# Altium schematic sheet MCU.SchDoc
size B; DrawnBy: PWS; Engineer: PWS; Organization: WIPAC; Revision: 1; SheetNumber: 4; SheetTotal: 7; DocumentNumber: 4
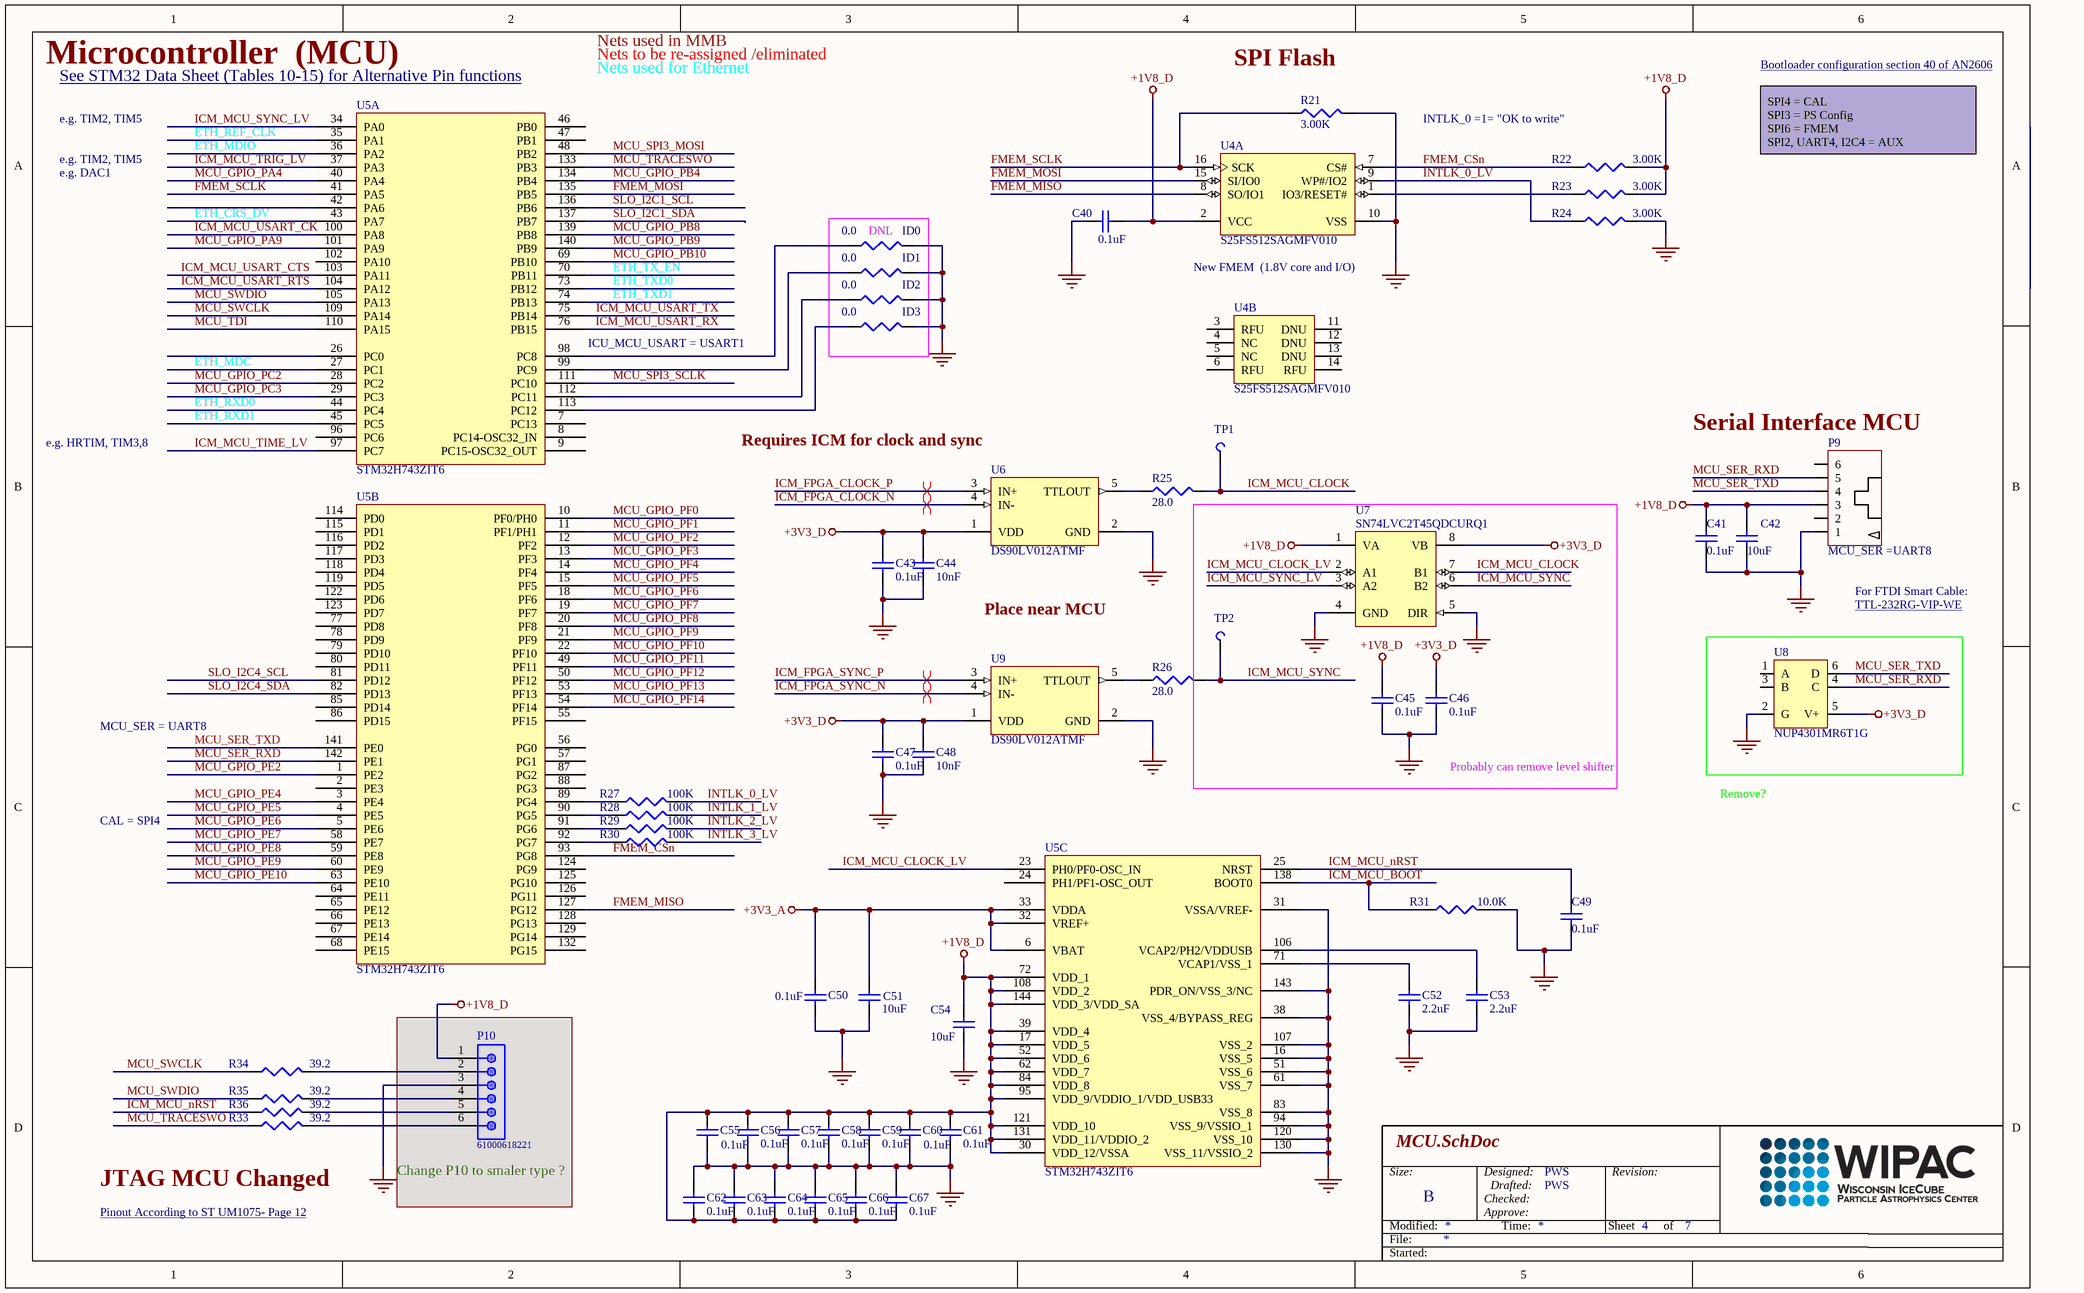
[diagram p0: MCU.SchDoc]

## Parts
C40  Capacitance: 0.1uF  [CAPC_0603]  (hidden comment: 0.1uF_603_50V)
C41  Capacitance: 0.1uF  [CAPC_0603]  (hidden comment: 0.1uF_603_50V)
C42  Capacitance: 10uF  [CAPC_1206]  (hidden comment: 10uF_1206_16V)
C43  Capacitance: 0.1uF  [CAPC_0603]  (hidden comment: 0.1uF_603_50V)
C44  10nF  [CAPC1608X90X35LL10T15]
C45  Capacitance: 0.1uF  [CAPC_0603]  (hidden comment: 0.1uF_603_50V)
C46  Capacitance: 0.1uF  [CAPC_0603]  (hidden comment: 0.1uF_603_50V)
C47  Capacitance: 0.1uF  [CAPC_0603]  (hidden comment: 0.1uF_603_50V)
C48  10nF  [CAPC1608X90X35LL10T15]
C49  Capacitance: 0.1uF  [CAPC_0603]  (hidden comment: 0.1uF_603_50V)
C50  Capacitance: 0.1uF  [CAPC_0603]  (hidden comment: 0.1uF_603_50V)
C51  Capacitance: 10uF  [CAPC_0805]  (hidden comment: 10uF_805_10V)
C52  Capacitance: 2.2uF  [CAPC_0805]  (hidden comment: 2.2uF_805_16V)
C53  Capacitance: 2.2uF  [CAPC_0805]  (hidden comment: 2.2uF_805_16V)
C54  Capacitance: 10uF  [CAPC_0805]  (hidden comment: 10uF_805_10V)
C55  Capacitance: 0.1uF  [CAPC_0603]  (hidden comment: 0.1uF_603_50V)
C56  Capacitance: 0.1uF  [CAPC_0603]  (hidden comment: 0.1uF_603_50V)
C57  Capacitance: 0.1uF  [CAPC_0603]  (hidden comment: 0.1uF_603_50V)
C58  Capacitance: 0.1uF  [CAPC_0603]  (hidden comment: 0.1uF_603_50V)
C59  Capacitance: 0.1uF  [CAPC_0603]  (hidden comment: 0.1uF_603_50V)
C60  Capacitance: 0.1uF  [CAPC_0603]  (hidden comment: 0.1uF_603_50V)
C61  Capacitance: 0.1uF  [CAPC_0603]  (hidden comment: 0.1uF_603_50V)
C62  Capacitance: 0.1uF  [CAPC_0603]  (hidden comment: 0.1uF_603_50V)
C63  Capacitance: 0.1uF  [CAPC_0603]  (hidden comment: 0.1uF_603_50V)
C64  Capacitance: 0.1uF  [CAPC_0603]  (hidden comment: 0.1uF_603_50V)
C65  Capacitance: 0.1uF  [CAPC_0603]  (hidden comment: 0.1uF_603_50V)
C66  Capacitance: 0.1uF  [CAPC_0603]  (hidden comment: 0.1uF_603_50V)
C67  Capacitance: 0.1uF  [CAPC_0603]  (hidden comment: 0.1uF_603_50V)
ID0  Resistance: 0.0  [RES_0603]  (hidden comment: R_ZERO_805)  (no BOM)
ID1  Resistance: 0.0  [RES_0603]  (hidden comment: R_ZERO_805)  (no BOM)
ID2  Resistance: 0.0  [RES_0603]  (hidden comment: R_ZERO_805)  (net tie, no BOM)
ID3  Resistance: 0.0  [RES_0603]  (hidden comment: R_ZERO_805)  (no BOM)
P9  MCU_SER =UART8  [Header Male 6 Vert]
P10  61000618221  [61000618221]
R21  Resistance: 3.00K  [RES_0603]  (hidden comment: R_3.00K_603_1%)
R22  Resistance: 3.00K  [RES_0603]  (hidden comment: R_3.00K_603_1%)
R23  Resistance: 3.00K  [RES_0603]  (hidden comment: R_3.00K_603_1%)
R24  Resistance: 3.00K  [RES_0603]  (hidden comment: R_3.00K_603_1%)
R25  Resistance: 28.0  [RES_0603]  (hidden comment: R_28.0_603_1%)
R26  Resistance: 28.0  [RES_0603]  (hidden comment: R_28.0_603_1%)
R27  Resistance: 100K  [RES_0603]  (hidden comment: R_100K_603_1%)
R28  Resistance: 100K  [RES_0603]  (hidden comment: R_100K_603_1%)
R29  Resistance: 100K  [RES_0603]  (hidden comment: R_100K_603_1%)
R30  Resistance: 100K  [RES_0603]  (hidden comment: R_100K_603_1%)
R31  value 10.0K  [RES_0603]  (hidden comment: R_10.0K_603_1%)
R33  Resistance: 39.2  [RES_0603]  (hidden comment: R_39.2_603_1%)
R34  Resistance: 39.2  [RES_0603]  (hidden comment: R_39.2_603_1%)
R35  Resistance: 39.2  [RES_0603]  (hidden comment: R_39.2_603_1%)
R36  Resistance: 39.2  [RES_0603]  (hidden comment: R_39.2_603_1%)
TP1  PC TEST POINT MINI SMD  [Test Point SM]  (value not drawn)
TP2  PC TEST POINT MINI SMD  [Test Point SM]  (value not drawn)
U4  S25FS512SAGMFV010  [MICT-SF-16_N]  (parts A,B of 2)
U5  STM32H743ZIT6  [STM-LQFP144_N]  (parts A,B,C of 3)
U6  DS90LV012ATMF  [MF05A_N]
U7  SN74LVC2T45QDCURQ1  [TI-DGK8_N]
U8  NUP4301MR6T1G  [ONSC-SC-74-6-318F-05_V]
U9  DS90LV012ATMF  [MF05A_N]

## Blocks framed on the sheet
DNL: ID0-ID3
Probably can remove level shifter: C45 C46 TP2 U7
Change P10 to smaler type ?: P10

## Nets
+1V8_D: C40.1 C41.2 C42.2 C45.2 C54.2 C55.2 C56.2 C57.2 C58.2 C59.2 C60.2 C61.2 C62.1 C63.1 C64.1 C65.1 C66.1 C67.1 P9.3 P10.1 R22.2 R23.2 U4.2(VCC) U5.17(VDD_5) U5.30(VDD_12/VSSA) U5.39(VDD_4) U5.52(VDD_6) U5.62(VDD_7) U5.72(VDD_1) U5.84(VDD_8) U5.95(VDD_9/VDDIO_1/VDD_USB33) U5.108(VDD_2) U5.121(VDD_10) U5.131(VDD_11/VDDIO_2) U5.144(VDD_3/VDD_SA) U7.1(VA)
+3V3_A: C50.2 C51.2 U5.6(VBAT) U5.32(VREF+) U5.33(VDDA)
+3V3_D: C43.2 C44.2 C46.2 C47.2 C48.2 U6.1(VDD) U7.8(VB) U8.5(V+) U9.1(VDD)
GND: C40.2 C41.1 C42.1 C43.1 C44.1 C45.1 C46.1 C47.1 C48.1 C49.1 C50.1 C51.1 C52.1 C53.1 C54.1 C55.1 C56.1 C57.1 C58.1 C59.1 C60.1 C61.1 C62.2 C63.2 C64.2 C65.2 C66.2 C67.2 ID0.2 ID1.2 ID2.2 ID3.2 P9.1 P10.3 R21.2 R24.2 R31.2 U4.10(VSS) U5.16(VSS_5) U5.31(VSSA/VREF-) U5.38(VSS_4/BYPASS_REG) U5.51(VSS_6) U5.61(VSS_7) U5.83(VSS_8) U5.94(VSS_9/VSSIO_1) U5.107(VSS_2) U5.120(VSS_10) U5.130(VSS_11/VSSIO_2) U5.143(PDR_ON/VSS_3/NC) U6.2(GND) U7.4(GND) U7.5(DIR) U8.2(G) U9.2(GND)
ETH_CRS_DV: U5.43(PA7)
ETH_MDC: U5.27(PC1)
ETH_MDIO: U5.36(PA2)
ETH_REF_CLK: U5.35(PA1)
ETH_RXD0: U5.44(PC4)
ETH_RXD1: U5.45(PC5)
ETH_TX_EN: U5.70(PB11)
ETH_TXD0: U5.73(PB12)
ETH_TXD1: U5.74(PB13)
FMEM_CSn: R22.1 U4.7(CS#) U5.93(PG8)
FMEM_MISO: U4.8(SO/IO1) U5.127(PG12)
FMEM_MOSI: U4.15(SI/IO0) U5.135(PB5)
FMEM_SCLK: R21.1 U4.16(SCK) U5.41(PA5)
ICM_FPGA_CLOCK_N: U6.4(IN-)
ICM_FPGA_CLOCK_P: U6.3(IN+)
ICM_FPGA_SYNC_N: U9.4(IN-)
ICM_FPGA_SYNC_P: U9.3(IN+)
ICM_MCU_BOOT: R31.1 U5.138(BOOT0)
ICM_MCU_CLOCK: R25.2 TP1.1 U7.7(B1)
ICM_MCU_CLOCK_LV: U5.23(PH0/PF0-OSC_IN) U7.2(A1)
ICM_MCU_nRST: C49.2 R36.1 U5.25(NRST)
ICM_MCU_SYNC: R26.2 TP2.1 U7.6(B2)
ICM_MCU_SYNC_LV: U5.34(PA0) U7.3(A2)
ICM_MCU_TIME_LV: U5.97(PC7)
ICM_MCU_TRIG_LV: U5.37(PA3)
ICM_MCU_USART_CK: U5.100(PA8)
ICM_MCU_USART_CTS: U5.103(PA11)
ICM_MCU_USART_RTS: U5.104(PA12)
ICM_MCU_USART_RX: U5.76(PB15)
ICM_MCU_USART_TX: U5.75(PB14)
INTLK_0_LV: R24.1 R27.2 U4.9(WP#/IO2)
INTLK_1_LV: R28.2
INTLK_2_LV: R29.2
INTLK_3_LV: R30.2
MCU_GPIO_PA4: U5.40(PA4)
MCU_GPIO_PA9: U5.101(PA9)
MCU_GPIO_PB4: U5.134(PB4)
MCU_GPIO_PB8: U5.139(PB8)
MCU_GPIO_PB9: U5.140(PB9)
MCU_GPIO_PB10: U5.69(PB10)
MCU_GPIO_PC2: U5.28(PC2)
MCU_GPIO_PC3: U5.29(PC3)
MCU_GPIO_PE2: U5.1(PE2)
MCU_GPIO_PE4: U5.3(PE4)
MCU_GPIO_PE5: U5.4(PE5)
MCU_GPIO_PE6: U5.5(PE6)
MCU_GPIO_PE7: U5.58(PE7)
MCU_GPIO_PE8: U5.59(PE8)
MCU_GPIO_PE9: U5.60(PE9)
MCU_GPIO_PE10: U5.63(PE10)
MCU_GPIO_PF0: U5.10(PF0/PH0)
MCU_GPIO_PF1: U5.11(PF1/PH1)
MCU_GPIO_PF2: U5.12(PF2)
MCU_GPIO_PF3: U5.13(PF3)
MCU_GPIO_PF4: U5.14(PF4)
MCU_GPIO_PF5: U5.15(PF5)
MCU_GPIO_PF6: U5.18(PF6)
MCU_GPIO_PF7: U5.19(PF7)
MCU_GPIO_PF8: U5.20(PF8)
MCU_GPIO_PF9: U5.21(PF9)
MCU_GPIO_PF10: U5.22(PF10)
MCU_GPIO_PF11: U5.49(PF11)
MCU_GPIO_PF12: U5.50(PF12)
MCU_GPIO_PF13: U5.53(PF13)
MCU_GPIO_PF14: U5.54(PF14)
MCU_SER_RXD: P9.5 U5.142(PE1) U8.4(C)
MCU_SER_TXD: P9.4 U5.141(PE0) U8.6(D)
MCU_SPI3_MOSI: U5.48(PB2)
MCU_SPI3_SCLK: U5.111(PC10)
MCU_SWCLK: R34.1 U5.109(PA14)
MCU_SWDIO: R35.1 U5.105(PA13)
MCU_TDI: U5.110(PA15)
MCU_TRACESWO: R33.1 U5.133(PB3)
SLO_I2C1_SCL: U5.136(PB6)
SLO_I2C1_SDA: U5.137(PB7)
SLO_I2C4_SCL: U5.81(PD12)
SLO_I2C4_SDA: U5.82(PD13)
NetC52_2: C52.2 U5.71(VCAP1/VSS_1)
NetC53_2: C53.2 U5.106(VCAP2/PH2/VDDUSB)
NetID0_1: ID0.1 U5.98(PC8)
NetID1_1: ID1.1 U5.99(PC9)
NetID2_1: ID2.1 U5.112(PC11)
NetID3_1: ID3.1 U5.113(PC12)
NetP10_2: P10.2 R34.2
NetP10_4: P10.4 R35.2
NetP10_5: P10.5 R36.2
NetP10_6: P10.6 R33.2
NetR23_1: R23.1 U4.1(IO3/RESET#)
NetR25_1: R25.1 U6.5(TTLOUT)
NetR26_1: R26.1 U9.5(TTLOUT)
NetR27_1: R27.1 U5.89(PG4)
NetR28_1: R28.1 U5.90(PG5)
NetR29_1: R29.1 U5.91(PG6)
NetR30_1: R30.1 U5.92(PG7)

Not connected (* = marked no-connect by the designer): P9 2 6; U4 3(RFU) 4(NC) 5(NC) 6(RFU) 11(DNU) 12(DNU) 13(DNU) 14(RFU); U5 2(PE3) 7(PC13) 8(PC14-OSC32_IN) 9(PC15-OSC32_OUT) 24(PH1/PF1-OSC_OUT) 26(PC0) 42(PA6) 46(PB0) 47(PB1) 55(PF15) 56(PG0) 57(PG1) 64(PE11) 65(PE12) 66(PE13) 67(PE14) 68(PE15) 77(PD8) 78(PD9) 79(PD10) 80(PD11) 85(PD14) 86(PD15) 87(PG2) 88(PG3) 96(PC6) 102(PA10) 114(PD0) 115(PD1) 116(PD2) 117(PD3) 118(PD4) 119(PD5) 122(PD6) 123(PD7) 124(PG9) 125(PG10) 126(PG11) 128(PG13) 129(PG14) 132(PG15); U8 1(A) 3(B)

## Layout directives
differential pair: ICM_FPGA_CLOCK_N, ICM_FPGA_CLOCK_P, ICM_FPGA_SYNC_N, ICM_FPGA_SYNC_P

## Notes on the sheet
- Microcontroller  (MCU)
- (near U5) See STM32 Data Sheet (Tables 10-15) for Alternative Pin functions
- Nets to be re-assigned /eliminated
- Nets used in MMB
- Nets used for Ethernet
- (near R21) SPI Flash
- Bootloader configuration section 40 of AN2606
- e.g. TIM2, TIM5
- (near R22) INTLK_0 =1= "OK to write"
- SPI4 = CAL
  SPI3 = PS Config
  SPI6 = FMEM
  SPI2, UART4, I2C4 = AUX
- e.g. DAC1
- (near U4) New FMEM  (1.8V core and I/O)
- ICU_MCU_USART = USART1
- (near P9) Serial Interface MCU
- e.g. HRTIM, TIM3,8
- (near U6) Requires ICM for clock and sync
- Place near MCU
- For FTDI Smart Cable:
- TTL-232RG-VIP-WE
- MCU_SER = UART8
- CAL = SPI4
- Remove?
- JTAG MCU Changed
- Pinout According to ST UM1075- Page 12
- Size:
- Designed:
- Revision:
- Modified:
- File:
- B
- Checked:
- Approve:
- Drafted:
- Time:
- Sheet
- of
- Started:

## Library data of the parts
C40 C43 C45-C47 C50 C55-C67 = CapC_0.1uF_603_50V: 0.1µF ±10% 50V Ceramic Capacitor X7R 0603 (1608 Metric); Manufacturer: TDK; Manufacturer Part Number: CGJ3E2X7R1H104K080AA; Ratings: COTS; ComponentLink1Description: Datasheet; ComponentLink1URL: https://product.tdk.com/info/en/catalog/datasheets/mlcc_highreliability_general_en.pdf; ComponentLink2Description: Supplier Link; ComponentLink2URL: https://www.digikey.com/products/en?keywords=445-8122-1-ND; Supplier 1: Digi-Key; Stock 1: 697211; Pricing 1: 1 = 0.22000, 10 = 0.15300, 100 = 0.07740, 500 = 0.05294, 1000 = 0.04683 (USD); RoHS: Yes; Mount: Surface Mount; Case/Package: 0603; Weight: 7.1E-05oz; Case Code (Imperial): 0603; Case Code (Metric): 1608; Min Operating Temperature: -55°C; Max Operating Temperature: 125°C; Tolerance: 10%; Voltage Rating: 50V; Voltage Rating (DC): 50V; Packaging: Tape and Reel; Package Quantity: 1; Dielectric: X7R; Termination: SMD/SMT; Composition: Ceramic; Length: 1.6mm; Height: 0.8mm; Width: 0.8mm; Thickness: 0.035inch; Depth: 0.8mm; Radiation Hardening: No; Lead Free: Lead Free; Supplier Part Number 1: 445-8122-1-ND
C41 C49 = CapC_0.1uF_603_50V_GCJ: 0.1µF ±10% 50V Ceramic Capacitor X7R 0603 (1608 Metric); Manufacturer: Murata; Manufacturer Part Number: GCJ188R71H104KA12D; Supplier 1: Digi-Key; Supplier Part Number 1: 490-5798-1-ND; RoHS: Yes; Packaging: Tape and Reel; Tolerance: 10%; Ratings: AEC-Q200; ComponentLink1URL: https://psearch.en.murata.com/capacitor/product/GCJ188R71H104KA12%23.pdf; ComponentLink1Description: Datasheet; ComponentLink2Description: Supplier Link; ComponentLink2URL: https://www.digikey.com/products/en?keywords=490-5798-1-ND; Stock 1: 2321609; Pricing 1: 1=0.28000, 10=0.19200, 100=0.10890, 500=0.07686, 1000=0.06725 (USD); Mount: Surface Mount; Case/Package: 0603; Case Code (Imperial): 0603; Case Code (Metric): 1608; Min Operating Temperature: -55°C; Max Operating Temperature: 125°C; Voltage Rating: 50V; Dielectric: X7R; Termination: SMD/SMT; Voltage Rating (DC): 50V; Package Quantity: 1; Length: 1.6mm; Height: 0.8mm; Width: 0.031inch; Thickness: 0.035inch; Features: Soft Termination; Depth: 0.8mm; Radiation Hardening: No; Lead Free: Lead Free
C42 = CapC_10uF_1206_16V: Capacitor; Manufacturer: Murata; Manufacturer Part Number: GCJ31CR71C106KA15L; Voltage Rating: 16V; Tolerance: 10%; Dielectric: X7R; Supplier 1: Digi-Key; Stock 1: 43020; Pricing 1: 1 = 0.79000, 10 = 0.56200, 100 = 0.36990, 500 = 0.27402, 1000 = 0.23292 (USD); RoHS: Yes; Mount: Surface Mount; Case/Package: 1206; Case Code (Metric): 3216; Case Code (Imperial): 1206; Min Operating Temperature: -55°C; Max Operating Temperature: 125°C; Package Quantity: 2000; Packaging: Tape and Reel; Termination: SMD/SMT; Voltage Rating (DC): 16V; Features: Soft Termination; Length: 0.126inch; Width: 1.6mm; Thickness: 0.075inch; Ratings: AEC-Q200; ComponentLink1URL: https://www.murata.com/~/media/webrenewal/support/library/catalog/products/capacitor/mlcc/c03e.ashx?la=en-us; ComponentLink1Description: Datasheet; Supplier Part Number 1: 490-10558-1-ND; ComponentLink2Description: Supplier Link; ComponentLink2URL: https://www.digikey.com/products/en?keywords=490-10558-1-ND; Weight: 0.001411oz; Height: 1.25mm
C44 C48 = CMP-2000-06338-1: Chip Capacitor, 10000 pF, +/- 10%, 16 V, -55 to 125 degC, 0603 (1608 Metric), RoHS, Tape and Reel; Manufacturer: Murata; Rated Voltage: 16V; Dielectric: X7R; Mounting Technology: SurfaceMount; Tolerance (%): ±10%; Case Size/Dimension: 0603; Datasheet URL: http://search.murata.co.jp/Ceramy/image/img/A01X/G101/ENG/GRM188R71C103KA01-01.pdf; Datasheet Version: 02/2016; Manufacturer URL: http://www.murata.com/; Package Reference: 0603; Package Description: 2-Pin Surface Mount Device, Body 1.6 x 0.8 mm; Capacitance: 10nF
C51 C54 = CapC_10uF_805_10V: Capacitor; Manufacturer: Murata; Manufacturer Part Number: GCJ21BR71A106KE01L; Tolerance: 10%; Dielectric: X7R; Voltage Rating: 10V; Supplier 1: Digi-Key; Supplier Part Number 1: 490-12646-1-ND; RoHS: Yes; ComponentLink1URL: https://www.murata.com/~/media/webrenewal/support/library/catalog/products/capacitor/mlcc/c03e.ashx?la=en-us; ComponentLink1Description: Datasheet; Stock 1: 140399; Pricing 1: 1 = 0.70000, 10 = 0.49300, 100 = 0.32440, 500 = 0.24032, 1000 = 0.20428 (USD); ComponentLink2URL: https://www.digikey.com/products/en?keywords=490-12646-1-ND; ComponentLink2Description: Supplier Link; Mount: Surface Mount; Case/Package: 0805; Weight: 0.000335oz; Case Code (Metric): 2012; Case Code (Imperial): 0805; Min Operating Temperature: -55°C; Max Operating Temperature: 125°C; Packaging: Tape and Reel; Termination: SMD/SMT; Voltage Rating (DC): 10V; Package Quantity: 3000; Features: Soft Termination; Length: 2mm; Height: 1.25mm; Width: 0.049inch; Thickness: 0.057inch; Depth: 1.25mm; Ratings: AEC-Q200
C52 C53 = CapC_2.2uF_805_16V: CAP CER 2.2UF 16V X7R 0805; Manufacturer: Murata; Manufacturer Part Number: GCJ21BR71C225KA13L; Tolerance: 10%; Supplier 1: Digi-Key; Stock 1: 18374; Pricing 1: 1 = 0.52000, 10 = 0.35900, 100 = 0.21520, 500 = 0.16138, 1000 = 0.13628 (USD); RoHS: Yes; Mount: Surface Mount; Case/Package: 0805; Case Code (Metric): 2012; Case Code (Imperial): 0805; Min Operating Temperature: -55°C; Max Operating Temperature: 125°C; Packaging: Tape and Reel; Voltage Rating: 16V; Length: 2mm; Width: 0.049inch; Thickness: 0.057inch; Ratings: AEC-Q200; Supplier Part Number 1: 490-5801-1-ND; ComponentLink1Description: Supplier Link; ComponentLink1URL: https://www.digikey.com/products/en?keywords=490-5801-1-ND; ComponentLink2Description: Datasheet; ComponentLink2URL: https://psearch.en.murata.com/capacitor/product/GCJ21BR71C225KA13%23.pdf; Features: Soft Termination; Package Quantity: 1; Dielectric: X7R; Termination: SMD/SMT; Voltage Rating (DC): 16V; Height: 1.25mm; Depth: 1.25mm; Radiation Hardening: No; Lead Free: Lead Free; ComponentLink3URL: https://datasheet.ciiva.com/172/product-172726.pdf?src-supplier=Digi-Key; ComponentLink3Description: https://datasheet.ciiva.com/172/product-172726.pdf?src-supplier=Digi-Key; ComponentLink4URL: https://datasheet.ciiva.com/172/s0717e-172727.pdf?src-supplier=Digi-Key; ComponentLink4Description: https://datasheet.ciiva.com/172/s0717e-172727.pdf?src-supplier=Digi-Key; ComponentLink5URL: https://datasheet.ciiva.com/172/s0717e-172728.pdf?src-supplier=Digi-Key; ComponentLink5Description: https://datasheet.ciiva.com/172/s0717e-172728.pdf?src-supplier=Digi-Key
ID0-ID3 = R_ZERO_805: RES ZERO OHM 0805 SMD; Manufacturer: Panasonic; Manufacturer Part Number: ERJ6GEY0R00V; Voltage Rating: 150V; Power Rating: 125mW; Tolerance: 5%; Temperature Coefficient: 600ppm/°C; Current Rating: 2A; Supplier 1: Digi-Key; Stock 1: 5556612; Pricing 1: 1 = 0.10000, 10 = 0.06000, 25 = 0.04320, 50 = 0.03300, 100 = 0.02430, 250 = 0.01852, 500 = 0.01482, 1000 = 0.01090 (USD); RoHS: Yes; Mount: Surface Mount; Case/Package: 0805; Contact Plating: Tin; Case Code (Imperial): 0805; Case Code (Metric): 2012; Min Operating Temperature: -55°C; Max Operating Temperature: 155°C; Composition: Thick Film; Packaging: Tape and Reel; Package Quantity: 1; Termination: SMD/SMT; Number of Terminations: 2; Military Standard: Not; Max Power Dissipation: 125mW; Voltage Rating (DC): 150V; Features: Automotive AEC-Q200; Length: 2mm; Height: 0.6mm; Width: 1.25mm; Depth: 1.25mm; Radiation Hardening: No; Lead Free: Lead Free; REACH SVHC: No SVHC; ComponentLink1URL: https://datasheet.ciiva.com/11821/0900766b80f806dd-11821735.pdf?src-supplier=RSComponents; ComponentLink1Description: https://datasheet.ciiva.com/11821/0900766b80f806dd-11821735.pdf?src-supplier=RSComponents; ComponentLink2URL: https://datasheet.ciiva.com/36526/1989607-36526237.pdf?src-supplier=Jameco; ComponentLink2Description: https://datasheet.ciiva.com/36526/1989607-36526237.pdf?src-supplier=Jameco; ComponentLink3URL: https://datasheet.ciiva.com/28695/1678796-28695877.pdf?src-supplier=Element14; ComponentLink3Description: https://datasheet.ciiva.com/28695/1678796-28695877.pdf?src-supplier=Element14; ComponentLink4URL: https://datasheet.ciiva.com/43460/1678796-43460073.pdf?src-supplier=Farnell; ComponentLink4Description: https://datasheet.ciiva.com/43460/1678796-43460073.pdf?src-supplier=Farnell; ComponentLink5URL: https://datasheet.ciiva.com/9117/aoa0000ce1-9117354.pdf?src-supplier=Avnet; ComponentLink5Description: https://datasheet.ciiva.com/9117/aoa0000ce1-9117354.pdf?src-supplier=Avnet; ComponentLink6URL: https://datasheet.ciiva.com/46377/1678796-46377866.pdf?src-supplier=Element14; ComponentLink6Description: https://datasheet.ciiva.com/46377/1678796-46377866.pdf?src-supplier=Element14; ComponentLink7URL: https://datasheet.ciiva.com/17215/aoa0000ce1-17215390.pdf?src-supplier=Avnet+Europe; ComponentLink7Description: https://datasheet.ciiva.com/17215/aoa0000ce1-17215390.pdf?src-supplier=Avnet+Europe; ComponentLink8URL: https://datasheet.ciiva.com/16512/aoa0000ce1-16512111.pdf?src-supplier=Avnet+Asia; ComponentLink8Description: https://datasheet.ciiva.com/16512/aoa0000ce1-16512111.pdf?src-supplier=Avnet+Asia; Supplier Part Number 1: P0.0ACT-ND
P9 = Header Male SL-6-VERT: CONN HEADER 6POS .100 VERT 30AU; Manufacturer: Molex; Manufacturer Part Number: 0705430110; Connector Type: Male Pin; Number of Positions: 6; Pitch: 2.54mm; Contact Resistance: 30mR; Supplier 1: Digi-Key; RoHS: Yes; Stock 1: 1397; Pricing 1: 1=1.87000, 10=1.69400, 100=1.45240, 500=1.21030, 1440=1.03740, 5760=0.91983, 10080=0.89908 (USD); Packaging: Rail/Tube; Number of Rows: 1; Contact Mating Length: 0.24inch; Termination: Solder; Color: Black; ComponentLink1URL: https://datasheet.ciiva.com/3933/189370705430110-pcb-headers-3933231.pdf?src-supplier=Arrow; ComponentLink1Description: https://datasheet.ciiva.com/3933/189370705430110-pcb-headers-3933231.pdf?src-supplier=Arrow; Supplier Part Number 1: WM4126-ND; Mount: Through Hole; Contact Plating: Gold; Contact Material: Bronze; Housing Material: Polyester; Housing Color: Black; Min Operating Temperature: -40°C; Max Operating Temperature: 105°C; Number of Contacts: 6; Orientation: Straight; Length: 17.79mm; Depth: 6.6mm; ComponentLink2URL: https://datasheet.ciiva.com/6831/705430106-sd-6831991.pdf?src-supplier=Digi-Key; ComponentLink2Description: https://datasheet.ciiva.com/6831/705430106-sd-6831991.pdf?src-supplier=Digi-Key
P10 = 61000618221: WR-PHD Pin Header, SMT, pitch 2.54mm, Single Row, Vertical, 6pin; Pin Number: 6; Gender: Male; Rated Current: 3A; Working Voltage: 250VAC; Withstanding Voltage: 500VAC; Contact Resistance: 20mOhm; ComponentLink1Description: Manufacturer; ComponentLink1URL: http://www.we-online.de; ComponentLink2Description: Datasheet; ComponentLink2URL: https://katalog.we-online.de/em/datasheet/6100xx18221.pdf; Part Number: 61000618221; Published Date: June 2019; Publisher: Wurth Elektronik; Pitch: 2.54mm; Operating Temperature: -40 to +125degC; Mounting Technology: SMT; Packaging: Tube; Row Number: Single; Orientation: Vertical
R21-R24 = R_3.00K_603_1%: RES 3.00K OHM 1/10W 1% 0603 SMD; Manufacturer: Panasonic; Manufacturer Part Number: ERJ3EKF3001V; Temperature Coefficient: 100ppm/°C; Power Rating: 100mW; Voltage Rating: 75V; Supplier 1: Digi-Key; Supplier Part Number 1: P3.00KHCT-ND; RoHS: Yes; Packaging: Tape and Reel; Tolerance: 1%; Composition: Thick Film; Features: Automotive AEC-Q200; Height: 0.022inch; Number of Terminations: 2; ComponentLink1URL: https://datasheet.ciiva.com/16782/70260748-16782535.pdf?src-supplier=Allied+Electronics; ComponentLink1Description: https://datasheet.ciiva.com/16782/70260748-16782535.pdf?src-supplier=Allied+Electronics; Stock 1: 718346; Pricing 1: 1 = 0.10000, 10 = 0.06500, 100 = 0.02640, 1000 = 0.01186, 2500 = 0.01029 (USD); Mount: Surface Mount; Case/Package: 0603; Case Code (Metric): 1608; Case Code (Imperial): 0603; Contact Plating: Tin; Min Operating Temperature: -55°C; Max Operating Temperature: 155°C; Package Quantity: 1; Termination: SMD/SMT; Military Standard: Not; Max Power Dissipation: 100mW; Voltage Rating (DC): 75V; Length: 1.6mm; Width: 0.031inch; Depth: 0.8mm; Radiation Hardening: No; REACH SVHC: No SVHC; Lead Free: Lead Free; ComponentLink2URL: https://datasheet.ciiva.com/46373/1678782-46373975.pdf?src-supplier=Element14; ComponentLink2Description: https://datasheet.ciiva.com/46373/1678782-46373975.pdf?src-supplier=Element14; ComponentLink3URL: https://datasheet.ciiva.com/9116/aoa0000ce2-9116984.pdf?src-supplier=Avnet; ComponentLink3Description: https://datasheet.ciiva.com/9116/aoa0000ce2-9116984.pdf?src-supplier=Avnet; ComponentLink4URL: https://datasheet.ciiva.com/46386/1678782-46386728.pdf?src-supplier=Element14; ComponentLink4Description: https://datasheet.ciiva.com/46386/1678782-46386728.pdf?src-supplier=Element14; ComponentLink5URL: https://datasheet.ciiva.com/9116/aoa0000ce2-9116986.pdf?src-supplier=Avnet; ComponentLink5Description: https://datasheet.ciiva.com/9116/aoa0000ce2-9116986.pdf?src-supplier=Avnet; ComponentLink6URL: https://datasheet.ciiva.com/30198/aoa0000ce2-30198332.pdf?src-supplier=Onlinecomponents.com; ComponentLink6Description: https://datasheet.ciiva.com/30198/aoa0000ce2-30198332.pdf?src-supplier=Onlinecomponents.com; ComponentLink7URL: https://datasheet.ciiva.com/24027/aoa0000ce2-24027133.pdf?src-supplier=Mouser; ComponentLink7Description: https://datasheet.ciiva.com/24027/aoa0000ce2-24027133.pdf?src-supplier=Mouser; ComponentLink8URL: https://datasheet.ciiva.com/28565/1678782-28565103.pdf?src-supplier=Element14; ComponentLink8Description: https://datasheet.ciiva.com/28565/1678782-28565103.pdf?src-supplier=Element14
R25 R26 = R_28.0_603_1%: RES 28.0 OHM 1/10W 1% 0603 SMD; Manufacturer: Panasonic; Manufacturer Part Number: ERJ3EKF28R0V; Temperature Coefficient: 100ppm/°C; Power Rating: 100mW; Voltage Rating: 75V; Voltage Rating (DC): 50V; Supplier 1: Digi-Key; RoHS: Yes; Stock 1: 75130; Pricing 1: 1 = 0.10000, 10 = 0.06500, 100 = 0.02640, 1000 = 0.01186, 2500 = 0.01029 (USD); Packaging: Tape and Reel; Tolerance: 1%; Composition: Thick Film; Features: Automotive AEC-Q200; Height: 0.022inch; Number of Terminations: 2; ComponentLink1URL: https://datasheet.ciiva.com/46437/1678782-46437594.pdf?src-supplier=Element14; ComponentLink1Description: https://datasheet.ciiva.com/46437/1678782-46437594.pdf?src-supplier=Element14; Supplier Part Number 1: P28.0HCT-ND; Mount: Surface Mount; Case/Package: 0603; Case Code (Imperial): 0603; Case Code (Metric): 1608; Contact Plating: Tin; Min Operating Temperature: -55°C; Max Operating Temperature: 155°C; Package Quantity: 1; Max Power Dissipation: 100mW; Length: 1.6mm; Width: 0.8mm; Radiation Hardening: No; REACH SVHC: Yes; Lead Free: Lead Free; ComponentLink2URL: https://datasheet.ciiva.com/22676/1678782-22676667.pdf?src-supplier=Element14; ComponentLink2Description: https://datasheet.ciiva.com/22676/1678782-22676667.pdf?src-supplier=Element14; ComponentLink3URL: https://datasheet.ciiva.com/22736/1678782-22736555.pdf?src-supplier=Element14; ComponentLink3Description: https://datasheet.ciiva.com/22736/1678782-22736555.pdf?src-supplier=Element14
R27-R30 = R_100K_603_1%: RES 100K OHM 1/10W 1% 0603 SMD; Manufacturer: Panasonic; Manufacturer Part Number: ERJ3EKF1003V; Temperature Coefficient: 100ppm/°C; Power Rating: 100mW; Voltage Rating: 75V; Supplier 1: Digi-Key; Supplier Part Number 1: P100KHTR-ND; RoHS: Yes; Packaging: Tape and Reel; Tolerance: 1%; Composition: Thick Film; Features: Automotive AEC-Q200; Height: 0.022inch; Number of Terminations: 2; ComponentLink1URL: https://datasheet.ciiva.com/34303/1987476-34303566.pdf?src-supplier=Jameco; ComponentLink1Description: https://datasheet.ciiva.com/34303/1987476-34303566.pdf?src-supplier=Jameco; Stock 1: 5089820; Pricing 1: 5000 = 0.007730, 10000 = 0.006710, 25000 = 0.005900, 50000 = 0.005410, 125000 = 0.005300 (USD); Mount: Surface Mount; Case/Package: 0603; Number of Pins: 2; Weight: 7.1E-05oz; Contact Plating: Tin; Case Code (Imperial): 0603; Case Code (Metric): 1608; Min Operating Temperature: -55°C; Max Operating Temperature: 155°C; Package Quantity: 1; Termination: SMD/SMT; Military Standard: Not; Max Power Dissipation: 100mW; Voltage Rating (DC): 75V; Length: 1.6mm; Width: 0.8mm; Depth: 0.8mm; Radiation Hardening: No; REACH SVHC: No SVHC; Lead Free: Lead Free; ComponentLink2URL: https://datasheet.ciiva.com/30133/aoa0000ce2-30133845.pdf?src-supplier=Onlinecomponents.com; ComponentLink2Description: https://datasheet.ciiva.com/30133/aoa0000ce2-30133845.pdf?src-supplier=Onlinecomponents.com; ComponentLink3URL: https://datasheet.ciiva.com/16740/aoa0000ce2-16740662.pdf?src-supplier=Future+Electronics; ComponentLink3Description: https://datasheet.ciiva.com/16740/aoa0000ce2-16740662.pdf?src-supplier=Future+Electronics; ComponentLink4URL: https://datasheet.ciiva.com/15158/getdatasheetpartid-247527-15158907.pdf?src-supplier=Verical; ComponentLink4Description: https://datasheet.ciiva.com/15158/getdatasheetpartid-247527-15158907.pdf?src-supplier=Verical; ComponentLink5URL: https://datasheet.ciiva.com/16770/70260748-16770253.pdf?src-supplier=Allied+Electronics; ComponentLink5Description: https://datasheet.ciiva.com/16770/70260748-16770253.pdf?src-supplier=Allied+Electronics
R31 = R_10.0K_603_1%: RES 10.0K OHM 1/10W 1% 0603 SMD; Manufacturer: Panasonic; Manufacturer Part Number: ERJ3EKF1002V; Temperature Coefficient: 100ppm/°C; Max Power Dissipation: 100mW; Resistance: 10kR; Voltage Rating (DC): 75V; Supplier 1: Digi-Key; Supplier Part Number 1: P10.0KHCT-ND; RoHS: Yes; Packaging: Tape and Reel; Tolerance: 1%; Composition: Thick Film; Features: Automotive AEC-Q200; Height: 0.45mm; Number of Terminations: 2; ComponentLink1URL: https://industrial.panasonic.com/cdbs/www-data/pdf/RDA0000/DMA0000COL11.pdf?src-supplier=RSComponents; ComponentLink1Description: Tech Guide; Case/Package: 0603; Case Code (Imperial): 0603; Case Code (Metric): 1608; ComponentLink2Description: Supplier Link; ComponentLink2URL: https://www.digikey.com/products/en?keywords=P10.0KHCT-ND; ComponentLink3Description: Datasheet; ComponentLink3URL: https://industrial.panasonic.com/cdbs/www-data/pdf/RDA0000/AOA0000C304.pdf; Contact Plating: Tin; Depth: 0.8mm; Lead Free: Lead Free; Length: 1.6mm; Max Operating Temperature: 155°C; Military Standard: Not; Min Operating Temperature: -55°C; Mount: Surface Mount; Number of Pins: 2; Package Quantity: 1; Power Rating: 100mW; Pricing 1: 1 = 0.10000, 10 = 0.06500, 100 = 0.02640, 1000 = 0.01186, 2500 = 0.01029 (USD); Radiation Hardening: No; REACH SVHC: No SVHC; Stock 1: 15986261; Termination: SMD/SMT; Voltage Rating: 75V; Width: 0.031inch
R33-R36 = R_39.2_603_1%: RES 39.2 OHM 1/10W 1% 0603 SMD; Manufacturer: Panasonic; Manufacturer Part Number: ERJ-3EKF39R2V; Temperature Coefficient: 100ppm/°C; Voltage Rating: 75V; Power Rating: 100mW; Voltage Rating (DC): 50V; Supplier 1: Digi-Key; RoHS: Yes; Stock 1: 214870; Pricing 1: 1 = 0.10000, 10 = 0.06500, 100 = 0.02640, 1000 = 0.01186, 2500 = 0.01029 (USD); Packaging: Tape and Reel; Tolerance: 1%; Composition: Thick Film; Features: Automotive AEC-Q200; Height: 0.45mm; Number of Terminations: 2; ComponentLink1URL: https://datasheet.ciiva.com/16511/aoa0000ce2-16511754.pdf?src-supplier=Avnet+Asia; ComponentLink1Description: https://datasheet.ciiva.com/16511/aoa0000ce2-16511754.pdf?src-supplier=Avnet+Asia; Supplier Part Number 1: P39.2HCT-ND; Mount: Surface Mount; Case/Package: 0603; Contact Plating: Tin; Case Code (Imperial): 0603; Case Code (Metric): 1608; Min Operating Temperature: -55°C; Max Operating Temperature: 155°C; Package Quantity: 1; Military Standard: Not; Termination: SMD/SMT; Max Power Dissipation: 100mW; Length: 1.6mm; Width: 0.8mm; Depth: 0.8mm; Radiation Hardening: No; REACH SVHC: Unknown; Lead Free: Lead Free; ComponentLink2URL: https://datasheet.ciiva.com/16768/70260748-16768842.pdf?src-supplier=Allied+Electronics; ComponentLink2Description: https://datasheet.ciiva.com/16768/70260748-16768842.pdf?src-supplier=Allied+Electronics; ComponentLink3URL: https://datasheet.ciiva.com/9117/aoa0000ce2-9117259.pdf?src-supplier=Avnet; ComponentLink3Description: https://datasheet.ciiva.com/9117/aoa0000ce2-9117259.pdf?src-supplier=Avnet; ComponentLink4URL: https://datasheet.ciiva.com/30192/aoa0000ce2-30192907.pdf?src-supplier=Onlinecomponents.com; ComponentLink4Description: https://datasheet.ciiva.com/30192/aoa0000ce2-30192907.pdf?src-supplier=Onlinecomponents.com; ComponentLink5URL: https://datasheet.ciiva.com/5901/426256-5901661.pdf?src-supplier=Farnell; ComponentLink5Description: https://datasheet.ciiva.com/5901/426256-5901661.pdf?src-supplier=Farnell; ComponentLink6URL: https://datasheet.ciiva.com/17209/aoa0000ce2-17209901.pdf?src-supplier=Avnet+Europe; ComponentLink6Description: https://datasheet.ciiva.com/17209/aoa0000ce2-17209901.pdf?src-supplier=Avnet+Europe; ComponentLink7URL: https://datasheet.ciiva.com/16779/70260748-16779813.pdf?src-supplier=Allied+Electronics; ComponentLink7Description: https://datasheet.ciiva.com/16779/70260748-16779813.pdf?src-supplier=Allied+Electronics; ComponentLink8URL: https://datasheet.ciiva.com/46377/426256-46377078.pdf?src-supplier=Element14; ComponentLink8Description: https://datasheet.ciiva.com/46377/426256-46377078.pdf?src-supplier=Element14; ComponentLink9URL: https://datasheet.ciiva.com/46388/426256-46388618.pdf?src-supplier=Element14; ComponentLink9Description: https://datasheet.ciiva.com/46388/426256-46388618.pdf?src-supplier=Element14
TP1 TP2 = Test Point SM: 5019KCT-ND; Manufacturer: Keystone Electronics; Manufacturer Part Number: 5019; Supplier 1: Digi-Key; Supplier Part Number 1: 5019KCT-ND; RoHS: RoHS Compliant; Category: Test and Measurement; Stock: 10485; Pricing: 1=0.3, 10=0.287, 50=0.2092, 100=0.201, 250=0.18048, 500=0.17228 (USD); Packaging: Cut Tape (CT); Type: PC Test Point, Miniature; Terminal: 0.015" (0.38mm) Phosphor Bronze, Silver Plated; Mounting Type: Surface Mount; Material: Phosphor Bronze; Color: -; ComponentLink1URL: http://www.keyelco.com/product-pdf.cfm?p=1357; ComponentLink1Description: http://www.keyelco.com/product-pdf.cfm?p=1357
U4 = S25FS512SAGMFV010: IC FLASH 512M SPI 133MHZ 16SOIC; Manufacturer: Cypress; Supplier 1: Digi-Key; Manufacturer Part Number: S25FS512SAGMFV010; Stock 1: 221; Pricing 1: 1 = 8.400000, 10 = 7.729000, 25 = 7.568800, 50 = 7.541800, 240 = 6.765830, 480 = 6.560670, 720 = 6.239540, 1200 = 6.021000 (USD); RoHS: No; Supplier Part Number 1: S25FS512SAGMFV010-ND
U5 = STM32H743ZIT6: ARM® Cortex®-M7 STM32H7 Microcontroller IC 32-Bit 400MHz 2MB (2M x 8) FLASH 144-LQFP (20x20); Manufacturer: STMicroelectronics; Supplier 1: Digi-Key; Manufacturer Part Number: STM32H743ZIT6; Stock 1: 331; Pricing 1: 1 = 22.91000, 60 = 20.17900, 120 = 18.04242, 540 = 16.38059 (USD); RoHS: No; ComponentLink1URL: https://www.st.com/resource/en/datasheet/stm32h743bi.pdf; ComponentLink1Description: Datasheet; ComponentLink2URL: https://www.st.com/resource/en/reference_manual/dm00314099.pdf; ComponentLink2Description: STM32H743, 753, 750 Reference Manual; Supplier Part Number 1: 497-17721-ND; ComponentLink3Description: STM32H743xl Errata; ComponentLink3URL: https://www.st.com/resource/en/errata_sheet/dm00368411.pdf; ComponentLink4Description: Datasheet HTML; ComponentLink4URL: https://www.digikey.com/en/datasheets/stmicroelectronics/stmicroelectronics-en-dm00387108
U6 U9 = DS90LV012ATMF: 3V LVDS Single CMOS Differential Line Receiver, 5-pin SOT-23; Manufacturer: TI National Semiconductor; Manufacturer Part Number: DS90LV012ATMF/NOPB; Data Rate: 400Mbps; Number of Elements: 1; Propagation Delay: 3.5ns; Operating Supply Voltage: 3.3V; Max Supply Voltage: 3.6V; Min Supply Voltage: 2.7V; Max Power Dissipation: 2.26W; Max Supply Current: 9mA; Power Consumption: 18W; Supplier 1: Digi-Key; RoHS: Yes; Stock 1: 46821; Pricing 1: 1=1.05000, 10=0.93600, 100=0.72970, 500=0.60276 (USD); Packaging: Tape and Reel; ComponentLink1URL: http://www.ti.com/lit/ds/symlink/ds90lv012a.pdf; ComponentLink1Description: http://www.ti.com/lit/ds/symlink/ds90lv012a.pdf; Supplier Part Number 1: DS90LV012ATMF/NOPBCT-ND; ComponentLink2URL: https://datasheet.ciiva.com/15133/getdatasheetpartid-627853-15133191.pdf?src-supplier=Verical; ComponentLink2Description: https://datasheet.ciiva.com/15133/getdatasheetpartid-627853-15133191.pdf?src-supplier=Verical; ComponentLink3URL: https://datasheet.ciiva.com/41460/001187784-da-01-en-ic-line-ds90lv012atmf-nopb-sot-23-5-tid-41460741.pdf?src-supplier=Conrad; ComponentLink3Description: https://datasheet.ciiva.com/41460/001187784-da-01-en-ic-line-ds90lv012atmf-nopb-sot-23-5-tid-41460741.pdf?src-supplier=Conrad; ComponentLink4URL: https://datasheet.ciiva.com/1709/ds90lt012a-1709907.pdf?src-supplier=Digi-Key; ComponentLink4Description: https://datasheet.ciiva.com/1709/ds90lt012a-1709907.pdf?src-supplier=Digi-Key; ComponentLink5URL: https://datasheet.ciiva.com/3151/ds90lv012a-3151479.pdf?src-supplier=Avnet; ComponentLink5Description: https://datasheet.ciiva.com/3151/ds90lv012a-3151479.pdf?src-supplier=Avnet; ComponentLink6URL: https://datasheet.ciiva.com/1554/1849915-1554728.pdf?src-supplier=Farnell; ComponentLink6Description: https://datasheet.ciiva.com/1554/1849915-1554728.pdf?src-supplier=Farnell; ComponentLink7URL: https://datasheet.ciiva.com/3151/ds90lv012a-3151480.pdf?src-supplier=Avnet; ComponentLink7Description: https://datasheet.ciiva.com/3151/ds90lv012a-3151480.pdf?src-supplier=Avnet; ComponentLink8URL: https://datasheet.ciiva.com/1709/ds90lt012a-1709945.pdf?src-supplier=Digi-Key; ComponentLink8Description: https://datasheet.ciiva.com/1709/ds90lt012a-1709945.pdf?src-supplier=Digi-Key; ComponentLink9URL: https://datasheet.ciiva.com/1709/ds90lt012a-1709946.pdf?src-supplier=Digi-Key; ComponentLink9Description: https://datasheet.ciiva.com/1709/ds90lt012a-1709946.pdf?src-supplier=Digi-Key; Mount: Surface Mount; Case/Package: SOT-23; Number of Pins: 5; Min Operating Temperature: -40°C; Max Operating Temperature: 85°C; Number of Receivers: 1; Number of Drivers: 1; Turn-On Delay Time: 3.5ns; Power Dissipation: 2.26W; Number of Channels: 1; Package Quantity: 1000; Length: 2.92mm; Height: 1.02mm; Width: 1.6mm; Radiation Hardening: No; REACH SVHC: No SVHC; Lead Free: Lead Free
U7 = SN74LVC2T45QDCURQ1: Voltage Level Translator Bidirectional 1 Circuit 2 Channel 420Mbps SM8 (SSOP); Generic Part Number: SN74LVC2T45-Q1; Manufacturer: Texas Instruments; Manufacturer Part Number: SN74LVC2T45MDCTTEP; VCC(Min)(V): 1.65; VCC(Max)(V): 5.5; Output Type: CMOS; Logic: True; ICC @ Nom Voltage(Max)(mA): 0.004; Input Type: CMOS/TTL; Bits(#): 2; F @ Nom Voltage(Max)(Mhz): 150; Rating: Automotive; Technology Family: LVC; Voltage(Nom)(V): 1.8,2.5,3.3,5; Schmitt Trigger: No; Output Drive (IOL/IOH)(Max)(mA): 32/-32; Sub-Family: Dual Supply Translator; 3-State Output: Yes; tpd @ Nom Voltage(Max)(ns): 19.5,12,9.6,8.4; Max Supply Voltage: 5.5V; Min Supply Voltage: 1.65V; Propagation Delay: 3.5ns; Output Current: 32mA; Number of Elements: 1; Turn-On Delay Time: 53.2ns; Polarity: Non-Inverting; High Level Output Current: -32mA; Quiescent Current: 12mA; DatasheetVersion: SCES818; PackageReference: DCU0008A; Operating Temperature Range(C): -40 to 125; PartNumber: SN74LVC2T45QDCURQ1; ComponentLink1Description: Manufacturer URL; ComponentLink1URL: http://www.ti.com/; ComponentLink2Description: Datasheet; ComponentLink2URL: http://www.ti.com/lit/ds/symlink/sn74lvc2t45-q1.pdf; Supplier 1: Digi-Key; Stock 1: 5778; Pricing 1: 1 = 1.67000, 10 = 1.50100, 100 = 1.20660 (USD); RoHS: Yes; Mount: Surface Mount; Case/Package: SSOP; Number of Pins: 8; Weight: 0.000825oz; Contact Plating: Gold; Min Operating Temperature: -55°C; Max Operating Temperature: 125°C; Packaging: Tape and Reel; Package Quantity: 250; Number of Channels: 2; Data Rate: 420Mbps; Number of Inputs: 2; Direction: Bidirectional; Logic Function: Translator; Number of Bits: 2; Low Level Output Current: 32mA; Radiation Hardening: No; REACH SVHC: No SVHC; Lead Free: Lead Free; ComponentLink3URL: https://datasheet.ciiva.com/14316/sn74lvc2t45-ep-14316386.pdf?src-supplier=Avnet; ComponentLink3Description: https://datasheet.ciiva.com/14316/sn74lvc2t45-ep-14316386.pdf?src-supplier=Avnet; ComponentLink4URL: https://datasheet.ciiva.com/15086/getdatasheetpartid-144548-15086248.pdf?src-supplier=Verical; ComponentLink4Description: https://datasheet.ciiva.com/15086/getdatasheetpartid-144548-15086248.pdf?src-supplier=Verical; ComponentLink5URL: https://datasheet.ciiva.com/1899/sn74lvc2t45-ep-1899619.pdf?src-supplier=Digi-Key; ComponentLink5Description: https://datasheet.ciiva.com/1899/sn74lvc2t45-ep-1899619.pdf?src-supplier=Digi-Key; ComponentLink6URL: https://datasheet.ciiva.com/1899/sn74lvc2t45-ep-1899620.pdf?src-supplier=Digi-Key; ComponentLink6Description: https://datasheet.ciiva.com/1899/sn74lvc2t45-ep-1899620.pdf?src-supplier=Digi-Key; ComponentLink7URL: https://datasheet.ciiva.com/1899/sn74lvc2t45-ep-1899621.pdf?src-supplier=Digi-Key; ComponentLink7Description: https://datasheet.ciiva.com/1899/sn74lvc2t45-ep-1899621.pdf?src-supplier=Digi-Key; ComponentLink8URL: https://datasheet.ciiva.com/48701/001073867-da-01-en-ic-bus-trans-sn74lvc2t45mdcttep-sm-8-tid-48701957.pdf?src-supplier=Conrad; ComponentLink8Description: https://datasheet.ciiva.com/48701/001073867-da-01-en-ic-bus-trans-sn74lvc2t45mdcttep-sm-8-tid-48701957.pdf?src-supplier=Conrad; Supplier Part Number 1: 296-23952-1-ND
U8 = NUP4301MR6T1G: Low Capacitance Diode Array for ESD Protection in Four Data Lines, 6-Pin SC-74, Pb-Free, Tape and Reel; Manufacturer: ON Semiconductor; Direction: Bidirectional; Number of Lines: 4; Capacitance: 3pF; Min Breakdown Voltage: 70V; Power Line Protection: No; Leakage Current: 2.5uA; Forward Current: 715mA; Max Surge Current: 2A; Power Rating: 500W; ComponentLink1Description: Manufacturer URL; ComponentLink2Description: Datasheet; ComponentLink3URL: http://www.onsemi.com/pub_link/Collateral/318F-05.PDF; ComponentLink3Description: Package Specification; ComponentLink1URL: http://www.onsemi.com/; ComponentLink2URL: http://www.onsemi.com/pub/Collateral/NUP4301MR6T1-D.PDF; RoHS: Yes; ComponentLink4URL: https://datasheet.ciiva.com/353/nup4301mr6t1-d-353859.pdf?src-supplier=Avnet; ComponentLink4Description: https://datasheet.ciiva.com/353/nup4301mr6t1-d-353859.pdf?src-supplier=Avnet; ComponentLink5URL: https://datasheet.ciiva.com/353/nup4301mr6t1-d-353859.pdf?src-supplier=Digi-Key; ComponentLink5Description: https://datasheet.ciiva.com/353/nup4301mr6t1-d-353859.pdf?src-supplier=Digi-Key; ComponentLink6URL: https://datasheet.ciiva.com/22637/1708333-22637204.pdf?src-supplier=Element14; ComponentLink6Description: https://datasheet.ciiva.com/22637/1708333-22637204.pdf?src-supplier=Element14; ComponentLink7URL: https://datasheet.ciiva.com/29695/1185422-29695844.pdf?src-supplier=Jameco; ComponentLink7Description: https://datasheet.ciiva.com/29695/1185422-29695844.pdf?src-supplier=Jameco; ComponentLink8URL: https://datasheet.ciiva.com/17030/0900766b80dad825-17030492.pdf?src-supplier=Allied+Electronics; ComponentLink8Description: https://datasheet.ciiva.com/17030/0900766b80dad825-17030492.pdf?src-supplier=Allied+Electronics; ComponentLink9URL: https://datasheet.ciiva.com/26787/nup4301mr6t1g-26787833.pdf?src-supplier=IIIC; ComponentLink9Description: https://datasheet.ciiva.com/26787/nup4301mr6t1g-26787833.pdf?src-supplier=IIIC; ComponentLink10URL: https://datasheet.ciiva.com/353/nup4301mr6t1-d-353860.pdf?src-supplier=Digi-Key; ComponentLink10Description: https://datasheet.ciiva.com/353/nup4301mr6t1-d-353860.pdf?src-supplier=Digi-Key; ComponentLink11URL: https://datasheet.ciiva.com/353/nup4301mr6t1-d-353861.pdf?src-supplier=Digi-Key; ComponentLink11Description: https://datasheet.ciiva.com/353/nup4301mr6t1-d-353861.pdf?src-supplier=Digi-Key; ComponentLink12URL: https://datasheet.ciiva.com/8292/nup4301mr6t1-d-8292389.pdf?src-supplier=Avnet; ComponentLink12Description: https://datasheet.ciiva.com/8292/nup4301mr6t1-d-8292389.pdf?src-supplier=Avnet; ComponentLink13URL: https://datasheet.ciiva.com/15144/getdatasheetpartid-82731-15144533.pdf?src-supplier=Verical; ComponentLink13Description: https://datasheet.ciiva.com/15144/getdatasheetpartid-82731-15144533.pdf?src-supplier=Verical; ComponentLink14URL: https://datasheet.ciiva.com/7973/1916454-7973847.pdf?src-supplier=Element14; ComponentLink14Description: https://datasheet.ciiva.com/7973/1916454-7973847.pdf?src-supplier=Element14; ComponentLink15URL: https://datasheet.ciiva.com/16396/nup4301mr6t1-d-16396122.pdf?src-supplier=Future+Electronics; ComponentLink15Description: https://datasheet.ciiva.com/16396/nup4301mr6t1-d-16396122.pdf?src-supplier=Future+Electronics; Supplier 1: Digi-Key; Manufacturer Part Number: NUP4301MR6T1G; Stock 1: 26876; Pricing 1: 1 = 0.50000, 10 = 0.37400, 100 = 0.23310, 500 = 0.15952, 1000 = 0.12271 (USD); Case/Package: SC; Number of Pins: 6; Contact Plating: Tin; Min Operating Temperature: -40°C; Max Operating Temperature: 85°C; Package Quantity: 1; Packaging: Tape and Reel; Number of Bidirectional Channels: 4; Working Voltage: 70V; Peak Reverse Current: 2.5uA; Number of Channels: 4; Polarity: Bidirectional; Reverse Standoff Voltage: 70V; Max Breakdown Voltage: 70V; Max Repetitive Reverse Voltage (Vrrm): 70V; Peak Non-Repetitive Surge Current: 2A; Voltage Rating (DC): 70V; Breakdown Voltage: 70V; Reverse Voltage: 70V; Length: 3mm; Height: 0.94mm; Depth: 1.5mm; Width: 1.5mm; Radiation Hardening: No; Lead Free: Lead Free; Halogen Free: Halogen Free; REACH SVHC: No SVHC; Supplier Part Number 1: NUP4301MR6T1GOSCT-ND